# EAGLE design sanwa-obsf-30 (EAGLE 7.2.0)
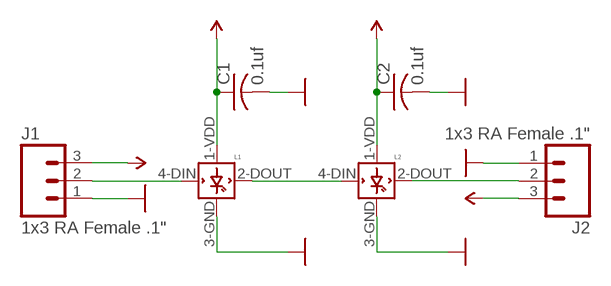
[diagram p0: schematic, sheet 1]

## Parts
C1  0.1uf  C-USC0603K  [C0603K]
C2  0.1uf  C-USC0603K  [C0603K]
J1  1x3 RA Female .1"  M03JST-PTH-VERT  [JST-3-PTH-VERT]
J2  1x3 RA Female .1"  M03JST-PTH-VERT  [JST-3-PTH-VERT]
L1  WS2812B  [WS2812B]
L2  WS2812B  [WS2812B]

## Nets
DATA: L1.2-DOUT(DOUT) L2.4-DIN(DIN)
DIN: J1.2 L1.4-DIN(DIN)
DOUT: J2.2 L2.2-DOUT(DOUT)
GND: C1.2 C2.2 J1.1 J2.1 L1.3-GND(GND) L2.3-GND(GND)
VCC: C1.1 C2.1 J1.3 J2.3 L1.1-VDD(VDD) L2.1-VDD(VDD)

## Library data of the parts
C1 C2 = rcl:C-US: CAPACITOR, American symbol
J1 J2 = SparkFun-Connectors:M03: Header 3 Standard 3-pin 0.1" header. Use with straight break away headers (SKU : PRT-00116), right angle break away headers (PRT-00553), swiss pins (PRT-00743), machine pins (PRT-00117), and female headers (PRT-00115). Molex polarized connector foot print use with SKU : PRT-08232 with associated crimp pins and housings.
L1 L2 = adafruit:WS2812B

## Board
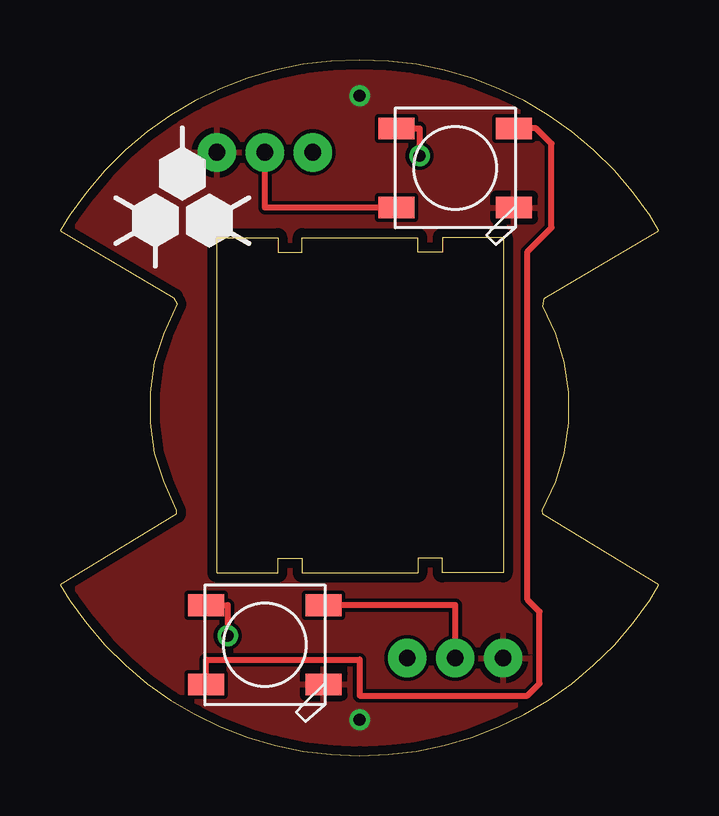
[diagram p1: board, top side]
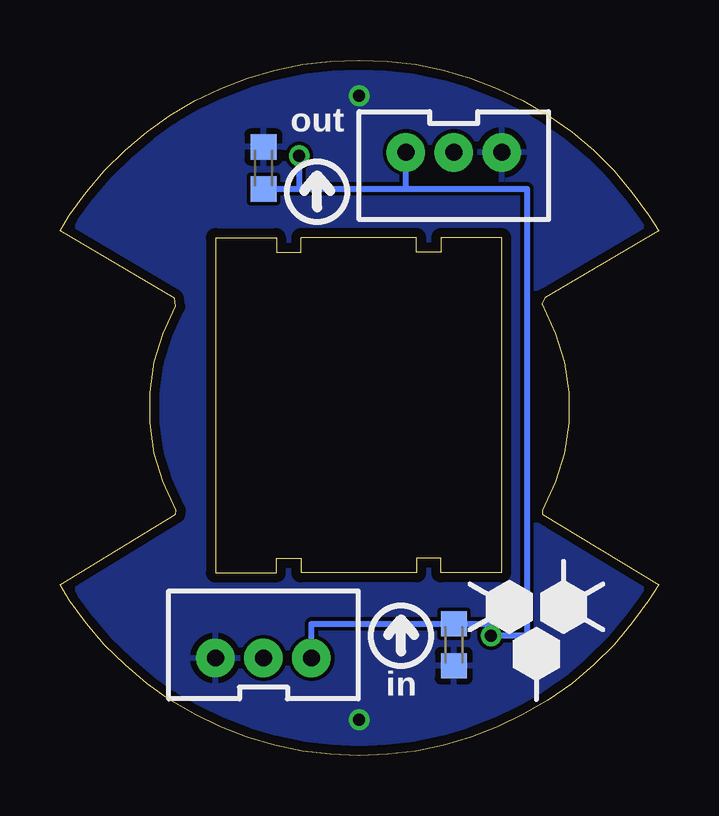
[diagram p2: board, bottom side, seen from below]

Size 24.97 x 28.98 mm. Coordinates in mm from the lower left corner, seen from the top.
Outline: 12.5,0 13.69,0.05 14.86,0.18 16.03,0.43 17.17,0.76 18.29,1.19 19.36,1.73 20.37,2.31 21.34,3 22.25,3.79 23.11,4.6 23.88,5.51 24.59,6.48 24.97,7.11 20.14,10.06 20.12,10.21 20.68,11.41 21.03,12.6 21.21,13.87 21.21,15.11 21.03,16.38 20.68,17.58 20.14,18.72 20.19,19.05 24.97,21.87 24.59,22.5 23.88,23.47 23.11,24.38 22.25,25.22 21.34,25.98 20.37,26.67 19.36,27.28 18.29,27.79 17.17,28.22 16.03,28.55 14.86,28.8 13.69,28.93 12.5,28.98 11.3,28.93 10.14,28.8 8.97,28.55 7.82,28.22 6.71,27.79 5.64,27.28 4.62,26.67 3.63,25.98 2.72,25.22 1.88,24.38 1.12,23.47 0.41,22.5 0,21.87 4.75,19.07 4.88,18.82 4.32,17.58 3.94,16.38 3.76,15.11 3.76,13.87 3.94,12.6 4.32,11.41 4.85,10.21 4.85,10.06 0,7.11 0.41,6.48 1.12,5.51 1.88,4.6 2.72,3.79 3.63,3 4.62,2.31 5.64,1.73 6.71,1.19 7.82,0.76 8.97,0.43 10.14,0.18 11.3,0.05 12.5,0
Outline: 18.48,21.58 18.48,7.61 15.94,7.61 15.94,8.22 14.93,8.22 14.93,7.61 10.1,7.61 10.1,8.22 9.08,8.22 9.08,7.61 6.54,7.61 6.54,21.58 9.08,21.58 9.08,20.98 10.1,20.98 10.1,21.58 14.93,21.58 14.93,20.98 15.94,20.98 15.94,21.58 18.48,21.58
Copper layers (1*16): Top 0.0356mm / dielectric 1.5011mm / Bottom 0.0356mm
Design rules "LaenPCBOrder *": minimum track width 6mil, minimum drill 13mil, track to track 6mil, track to pad 8mil, pad to pad 8mil, via to via 8mil, smd to smd 8mil, copper to edge 15mil, drill to drill 8mil, minimum pad ring 7mil, minimum via ring 7mil, stop-mask expansion 3mil, vias tented up to drill 0mil, thermal gap 10mil

### Footprints (pad centres in the part's own frame; a part is rotated, then mirrored left to right if it is on the bottom)
C0603K = smd 1.05 x 1.08: 1 -0.875,0; 2 0.875,0
JST-3-PTH-VERT = drill 0.7 pad 1.6: 1 -2,-0.55; 2 0,-0.55; 3 2,-0.55
WS2812B = smd 1.5 x 0.9: 1-VDD 2.45,-1.65; 2-DOUT 2.45,1.65; 3-GND -2.45,1.65; 4-DIN -2.45,-1.65

### Placement (x,y rotation side)
C1  8.54,4.61 270 bottom
C2  16.48,24.48 90 bottom
J1  16.48,4.61 0 bottom
J2  8.54,24.58 180 bottom
L1  8.54,4.61 180 top
L2  16.48,24.48 180 top

### Tracks (layer width: path | path; a pad name or v marks a point on that pad's centre or on a via)
DATA
  Top 0.254: L1.2-DOUT 6.09,3.99 12.49,3.99 12.49,2.49 19.49,2.49 19.99,2.99 19.99,5.99 19.49,6.49 19.49,20.99 20.49,21.99 20.49,25.49 19.85,26.13 L2.4-DIN
DIN
  Top 0.254: J1.2 16.48,6.26 L1.4-DIN
DOUT
  Top 0.254: L2.2-DOUT 8.54,22.83 J2.2
GND  (via drill 0.5)
  other vias: 12.49,27.49 12.49,1.49
  pour Bottom: 0.2,-0.02 0.2,29.73 25.2,29.73 25.2,-0.02
  pour Top: 0.2,-0.02 0.2,29.73 25.2,29.73 25.2,-0.02
VCC  (via drill 0.5)
  Top 0.254: L1.1-VDD 6.99,6.26 v6.99,4.99 | L2.1-VDD 14.99,26.13 v14.99,24.99
  Bottom 0.254: J1.3 14.48,5.49 C1.1 6.99,5.49 v6.99,4.99 5.49,4.99 5.49,23.61 10.54,23.61 | C2.1 14.99,23.61 | 14.99,23.61 10.54,23.61 | 10.54,23.61 J2.3 | v14.99,24.99 14.99,23.61

### Text on the board
bPlace: out | in